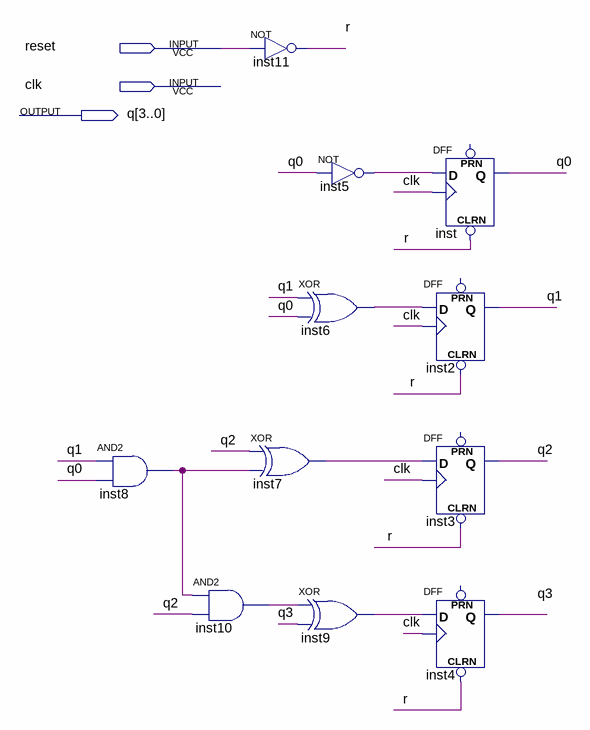
[diagram p0: schematic sheet]
// Quartus schematic pfs_inc_count.bdf as structural Verilog: 11 symbols, 3 pins
module pfs_inc_count (
  input  reset,
  input  clk,
  output [3:0] q
);

  wire inst5_out, inst6_out, inst7_out, inst8_out, inst9_out, inst10_out, r;

  and inst8 (inst8_out, q[1], q[0]);
  and inst10 (inst10_out, inst8_out, q[2]);
  not inst11 (r, reset);
  xor inst6 (inst6_out, q[1], q[0]);
  xor inst7 (inst7_out, q[2], inst8_out);
  xor inst9 (inst9_out, inst10_out, q[3]);
  not inst5 (inst5_out, q[0]);
  DFF inst (.CLRN(r), .CLK(clk), .D(inst5_out), .Q(q[0]));  // open: PRN
  DFF inst2 (.CLRN(r), .CLK(clk), .D(inst6_out), .Q(q[1]));  // open: PRN
  DFF inst3 (.CLRN(r), .CLK(clk), .D(inst7_out), .Q(q[2]));  // open: PRN
  DFF inst4 (.CLRN(r), .CLK(clk), .D(inst9_out), .Q(q[3]));  // open: PRN
endmodule
